# Altium schematic sheet GPIO.SchDoc
size 594 x 420 mm
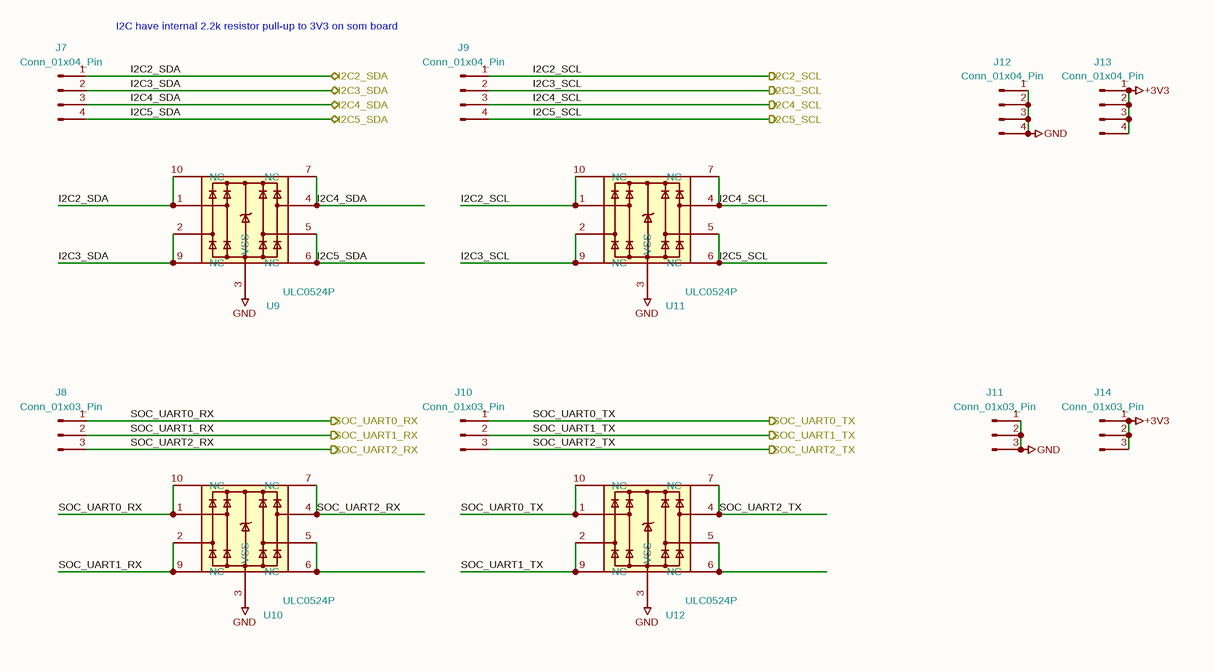
[diagram p0: GPIO.SchDoc]

## Parts
J7  Conn_01x04_Pin  [PinHeader_1x04_P2.54mm_Vertical]
J8  Conn_01x03_Pin  [PinHeader_1x03_P2.54mm_Vertical]
J9  Conn_01x04_Pin  [PinHeader_1x04_P2.54mm_Vertical]
J10  Conn_01x03_Pin  [PinHeader_1x03_P2.54mm_Vertical]
J11  Conn_01x03_Pin  [PinHeader_1x03_P2.54mm_Vertical]
J12  Conn_01x04_Pin  [PinHeader_1x04_P2.54mm_Vertical]
J13  Conn_01x04_Pin  [PinHeader_1x04_P2.54mm_Vertical]
J14  Conn_01x03_Pin  [PinHeader_1x03_P2.54mm_Vertical]
U9  ULC0524P  [Diodes_UDFN-10_1.0x2.5mm_P0.5mm]
U10  ULC0524P  [Diodes_UDFN-10_1.0x2.5mm_P0.5mm]
U11  ULC0524P  [Diodes_UDFN-10_1.0x2.5mm_P0.5mm]
U12  ULC0524P  [Diodes_UDFN-10_1.0x2.5mm_P0.5mm]

## Ports
I2C2_SCL (out), I2C2_SDA (bidir), I2C3_SCL (out), I2C3_SDA (bidir), I2C4_SCL (out), I2C4_SDA (bidir), I2C5_SCL (out), I2C5_SDA (bidir), SOC_UART0_RX (out), SOC_UART0_TX (out), SOC_UART1_RX (out), SOC_UART1_TX (out), SOC_UART2_RX (out), SOC_UART2_TX (out)

## Nets
+3V3: J13.1(Pin_1) J13.2(Pin_2) J13.3(Pin_3) J13.4(Pin_4) J14.1(Pin_1) J14.2(Pin_2) J14.3(Pin_3)
GND: J11.1(Pin_1) J11.2(Pin_2) J11.3(Pin_3) J12.1(Pin_1) J12.2(Pin_2) J12.3(Pin_3) J12.4(Pin_4) U9.3(VSS) U10.3(VSS) U11.3(VSS) U12.3(VSS)
I2C2_SCL: J9.1(Pin_1) U11.1 U11.10(NC) ; port I2C2_SCL
I2C2_SDA: J7.1(Pin_1) U9.1 U9.10(NC) ; port I2C2_SDA
I2C3_SCL: J9.2(Pin_2) U11.2 U11.9(NC) ; port I2C3_SCL
I2C3_SDA: J7.2(Pin_2) U9.2 U9.9(NC) ; port I2C3_SDA
I2C4_SCL: J9.3(Pin_3) U11.4 U11.7(NC) ; port I2C4_SCL
I2C4_SDA: J7.3(Pin_3) U9.4 U9.7(NC) ; port I2C4_SDA
I2C5_SCL: J9.4(Pin_4) U11.5 U11.6(NC) ; port I2C5_SCL
I2C5_SDA: J7.4(Pin_4) U9.5 U9.6(NC) ; port I2C5_SDA
SOC_UART0_RX: J8.1(Pin_1) U10.1 U10.10(NC) ; port SOC_UART0_RX
SOC_UART0_TX: J10.1(Pin_1) U12.1 U12.10(NC) ; port SOC_UART0_TX
SOC_UART1_RX: J8.2(Pin_2) U10.2 U10.9(NC) ; port SOC_UART1_RX
SOC_UART1_TX: J10.2(Pin_2) U12.2 U12.9(NC) ; port SOC_UART1_TX
SOC_UART2_RX: J8.3(Pin_3) U10.4 U10.7(NC) ; port SOC_UART2_RX
SOC_UART2_TX: J10.3(Pin_3) U12.4 U12.7(NC) ; port SOC_UART2_TX
NetU10_5: U10.5 U10.6(NC)
NetU12_5: U12.5 U12.6(NC)

Not connected (* = marked no-connect by the designer): U9 8(VSS); U10 8(VSS); U11 8(VSS); U12 8(VSS)

## Notes on the sheet
- I2C have internal 2.2k resistor pull-up to 3V3 on som board
- 1
- 2
- 3
- 4
- 5
- 6
- 7
- 8
- 9
- 10
- 11
- A
- B
- C
- D
- E
- F
- G
- H
- Title: Primer Carrier for LattePanda Mu
- File: GPIO.kicad_sch
- Sheet: /
- DFRobot
- KiCad E.D.A.  kicad (5.1.4)-1
- Size: A2
- Date: 2024-03-13
- Rev: V1.0.0
- Id: 1/1

## Library data of the parts
U9-U12 = D3V3XA4B10LP: Value: ULC0524P; Footprint: A_HDJ_Library:Diodes_UDFN-10_1.0x2.5mm_P0.5mm
J7 J9 J12 J13 = Conn_01x04_Pin: Value: Conn_01x04_Pin; Footprint: A_HDJ_Library:PinHeader_1x04_P2.54mm_Vertical
J8 J10 J11 J14 = Conn_01x03_Pin: Value: Conn_01x03_Pin; Footprint: A_HDJ_Library:PinHeader_1x03_P2.54mm_Vertical